# EAGLE design v1.1 (EAGLE 7.3.0)
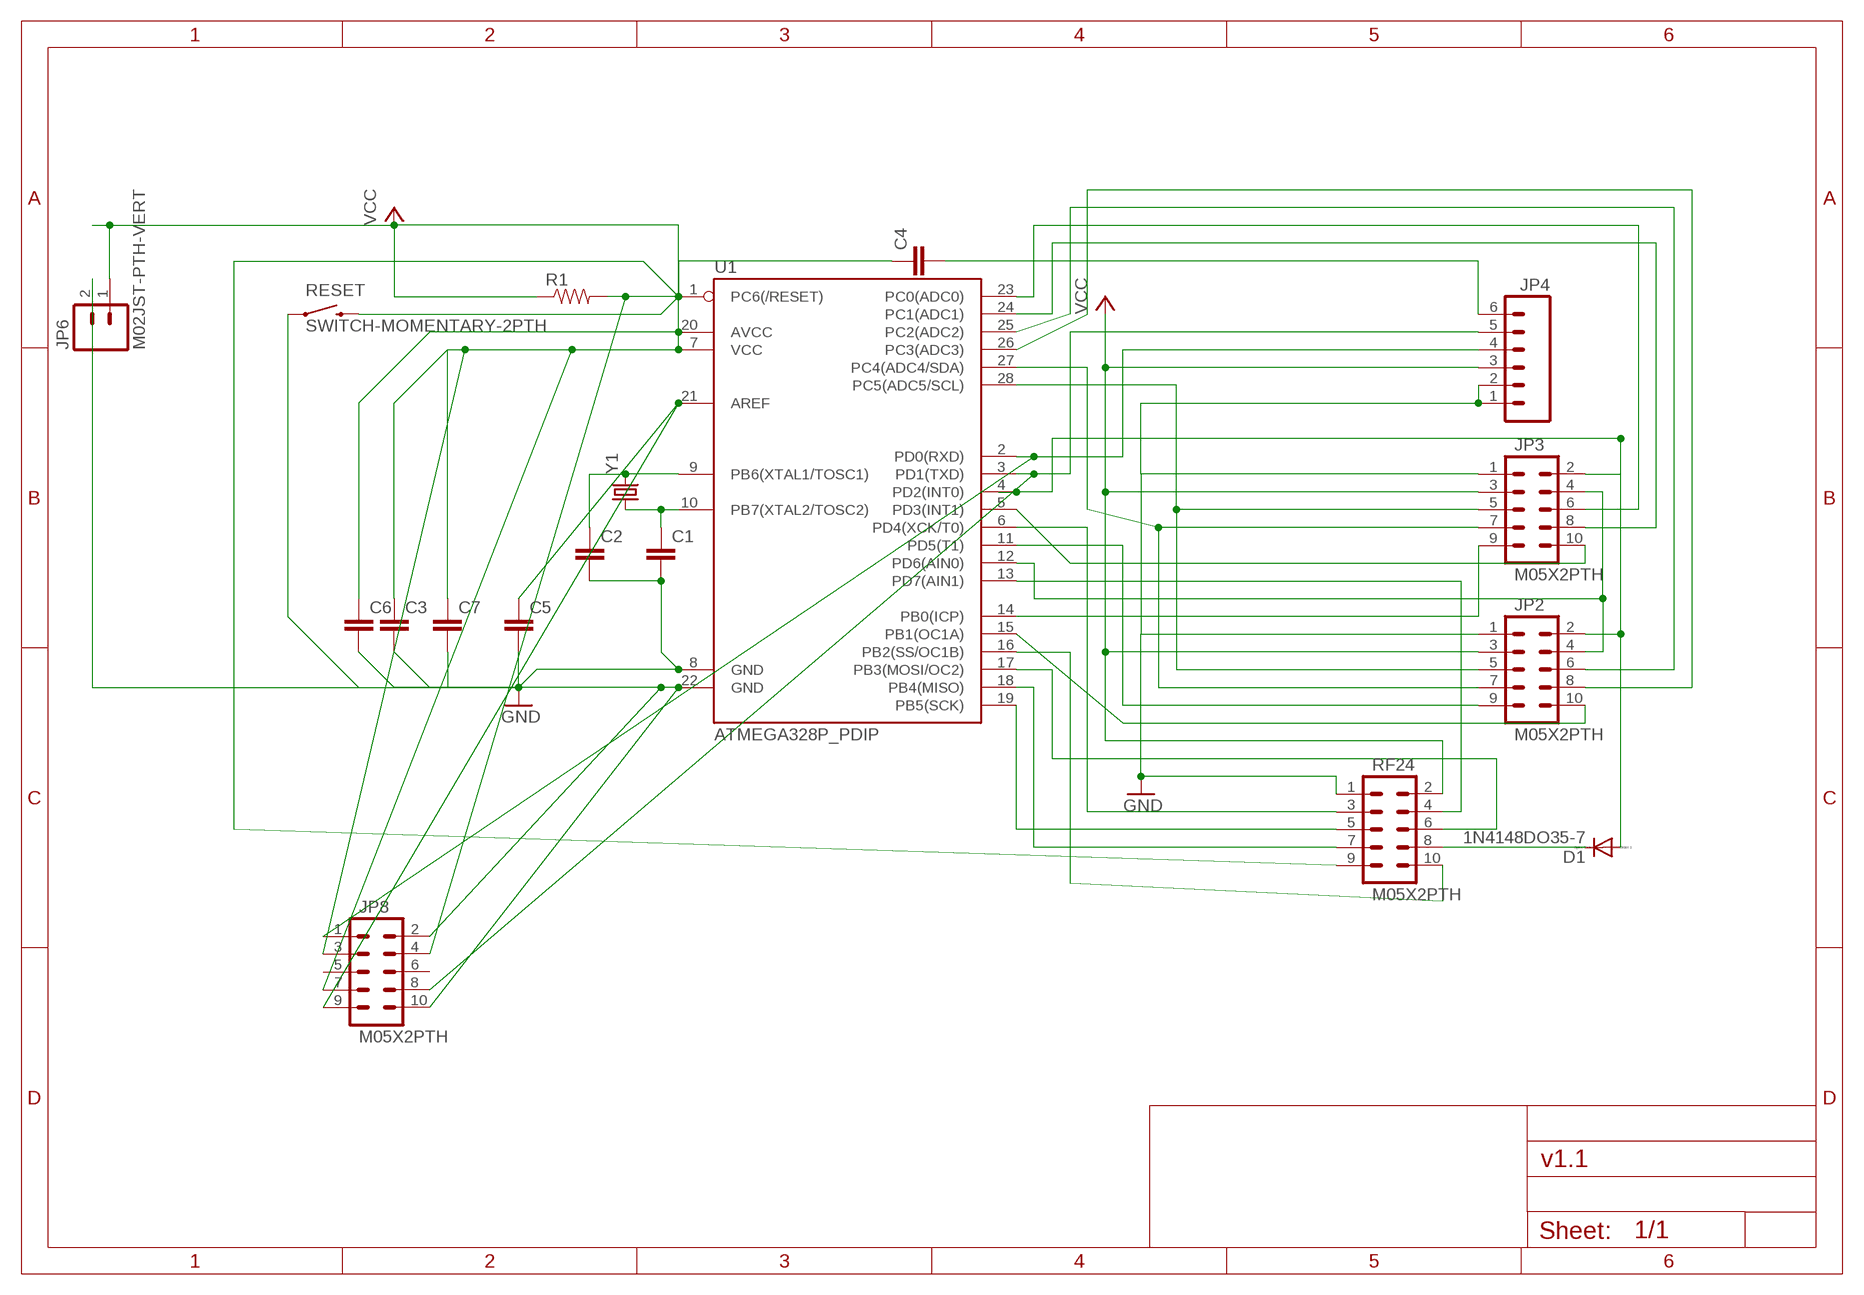
[diagram p0: schematic, sheet 1]

## Parts
C1  CAPPTH  [CAP-PTH-SMALL]
C2  CAPPTH  [CAP-PTH-SMALL]
C3  CAPPTH  [CAP-PTH-SMALL]
C4  CAPPTH  [CAP-PTH-SMALL]
C5  CAPPTH  [CAP-PTH-SMALL]
C6  CAPPTH  [CAP-PTH-SMALL]
C7  CAPPTH  [CAP-PTH-SMALL]
D1  1N4148DO35-7  [DO35-7]
JP2  M05X2PTH  [AVR_ICSP]
JP3  M05X2PTH  [AVR_ICSP]
JP4  M06SILK_FEMALE_PTH  [1X06]
JP6  M02JST-PTH-VERT  [JST-2-PTH-VERT]
JP8  M05X2PTH  [AVR_ICSP]
R1  RESISTORAXIAL-0.3  [AXIAL-0.3]
RESET  SWITCH-MOMENTARY-2PTH  [TACTILE-PTH]
RF24  M05X2PTH  [AVR_ICSP]
U1  ATMEGA328P_PDIP  [DIL28-3]
Y1  CRYSTALHC49US  [HC49US]

## Nets
GND: C1.2 C2.2 C3.2 C5.2 C6.2 C7.2 JP2.1 JP3.1 JP4.1 JP4.2 JP6.2 JP8.2 JP8.10 RESET.1 RF24.1 U1.8(GND) U1.22(GND)
N$1: C2.1 U1.9(PB6(XTAL1/TOSC1)) Y1.2
N$2: C4.1 JP8.4 R1.P$2 RESET.3 RF24.9 U1.1(PC6(/RESET))
N$3: C1.1 U1.10(PB7(XTAL2/TOSC2)) Y1.1
N$4: RF24.10 U1.16(PB2(SS/OC1B))
N$5: JP2.4 JP3.4 U1.12(PD6(AIN0))
N$6: C5.1 JP8.9 U1.21(AREF)
N$9: JP3.9 U1.14(PB0(ICP))
N$10: D1.A JP2.2 JP3.2 U1.4(PD2(INT0))
N$11: JP3.6 U1.23(PC0(ADC0))
N$12: JP3.8 U1.24(PC1(ADC1))
N$13: C4.2 JP4.6
N$14: JP2.6 U1.25(PC2(ADC2))
N$15: JP2.8 U1.26(PC3(ADC3))
N$16: RF24.6 U1.17(PB3(MOSI/OC2))
N$17: JP3.10 U1.5(PD3(INT1))
N$18: JP4.5 JP8.8 U1.3(PD1(TXD))
N$19: JP4.4 JP8.1 U1.2(PD0(RXD))
N$20: RF24.4 U1.13(PD7(AIN1))
N$21: JP2.5 JP3.5 U1.28(PC5(ADC5/SCL))
N$22: JP2.7 JP3.7 U1.27(PC4(ADC4/SDA))
N$23: RF24.5 U1.19(PB5(SCK))
N$24: D1.C RF24.8
N$25: RF24.3 U1.6(PD4(XCK/T0))
N$26: RF24.7 U1.18(PB4(MISO))
N$27: JP2.10 U1.15(PB1(OC1A))
N$28: JP2.9 U1.11(PD5(T1))
VCC: C3.1 C6.1 C7.1 JP2.3 JP3.3 JP4.3 JP6.1 JP8.3 JP8.7 R1.P$1 RF24.2 U1.7(VCC) U1.20(AVCC)
Unconnected: JP8.5 JP8.6

## Library data of the parts
C1-C7 = SparkFun-Passives:CAP: Capacitor Standard 0603 ceramic capacitor, and 0.1" leaded capacitor.
D1 = diode:1N4148: DIODE high speed (Philips)
JP2 JP3 JP8 RF24 = SparkFun-Connectors:M05X2: Header 5x2 Standard 10-pin dual row 0.1" header. Commonly used with AVR-ISP. Use with Spark Fun Electronics SKU: PRT-00778
JP4 = SparkFun-Connectors:M06: Header 6 Standard 6-pin 0.1" header. Use with straight break away headers (SKU : PRT-00116), right angle break away headers (PRT-00553), swiss pins (PRT-00743), machine pins (PRT-00117), and female headers (PRT-00115). Molex polarized connector foot print use with SKU : PRT-08094 with associated crimp pins and housings. NOTES ON THE VARIANTS LOCK and LOCK_LONGPADS... This footprint was designed to help hold the alignment of a through-hole component (i.e. 6-pin header) while soldering it into place. You may notice that each hole has been shifted either up or down by 0.005 of an inch from it's more standard position (which is a perfectly straight line). This slight alteration caused the pins (the squares in the middle) to touch the edges of the holes. Because they are alternating, it causes a "brace" to hold the component in place. 0.005 has proven to be the perfect amount of "off-center" position when using our standard breakaway headers. Although looks a little odd when you look at the bare footprint, once you have a header in there, the alteration is very hard to notice. Also,if you push a header all the way into place, it is covered up entirely on the bottom side. This idea of altering the position of holes to aid alignment will be further integrated into the Sparkfun Library for other footprints. It can help hold any component with 3 or more connection pins.; PROD_ID: CONN-08437
JP6 = SparkFun-Connectors:M02: Standard 2-pin 0.1" header. Use with - straight break away headers ( PRT-00116) - right angle break away headers (PRT-00553) - swiss pins (PRT-00743) - machine pins (PRT-00117) - female headers (PRT-00115) Molex polarized connector foot print use with: PRT-08233 with associated crimp pins and housings. 2.54_SCREWTERM for use with PRT-10571. 3.5mm Screw Terminal footprints for PRT-08084 5mm Screw Terminal footprints for use with PRT-08432
R1 = SparkFun-Passives:RESISTOR: Resistor Basic schematic elements and footprints for 0603, 1206, and PTH resistors.
RESET = SparkFun-Electromechanical:SWITCH-MOMENTARY-2: Various NO switches- pushbuttons, reed, etc
U1 = SparkFun-DigitalIC:ATMEGA328P_PDIP: uC used in the Arduino 32kb flash, 1k EEPROM, 2k SRAM This is the through-hole version of this chip.
Y1 = SparkFun-FreqCtrl:CRYSTAL: Various standard crystals. Proven footprints. Spark Fun Electronics SKU : COM-00534

## Net classes
0 default: clearance 0.205 mm

## Board
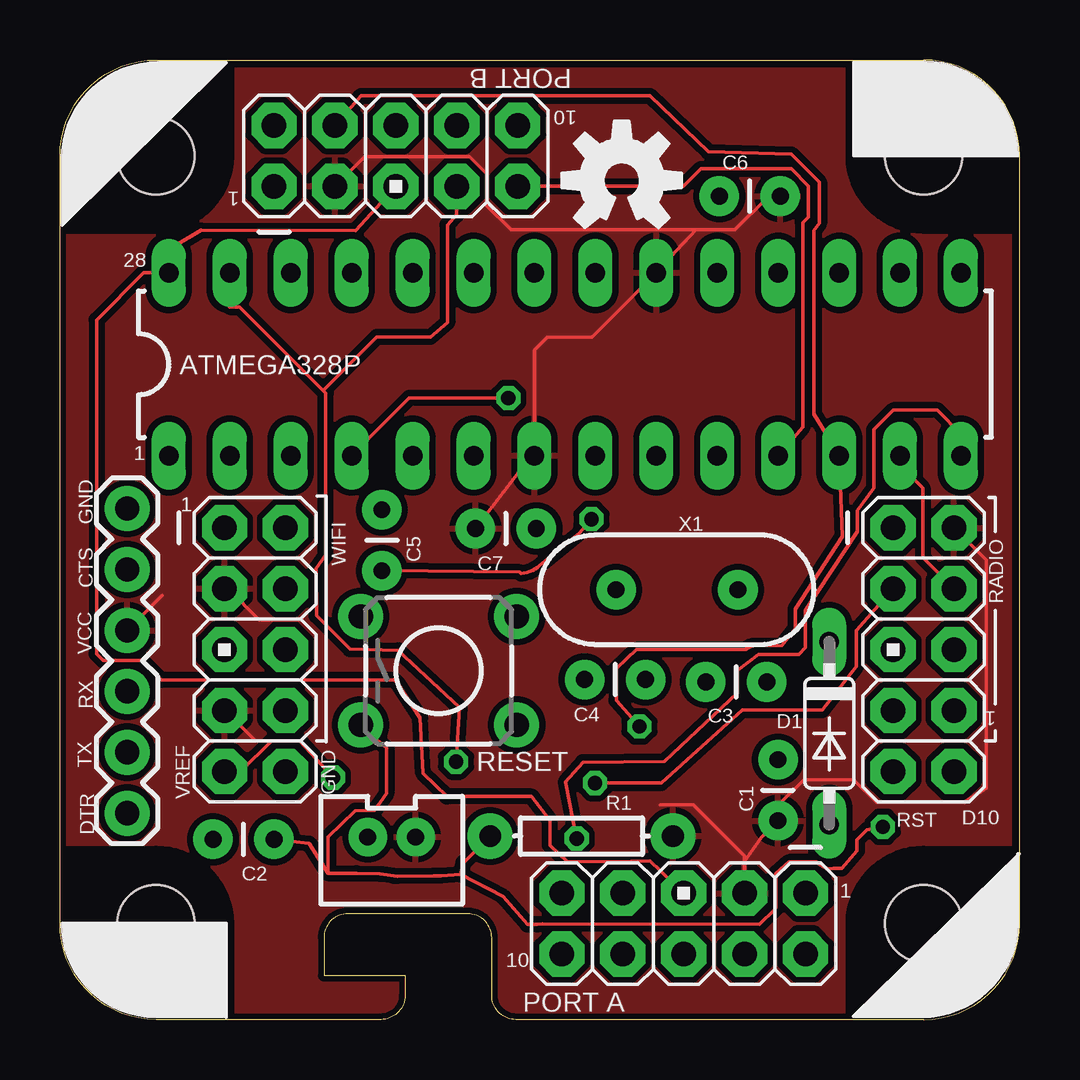
[diagram p1: board, top side]
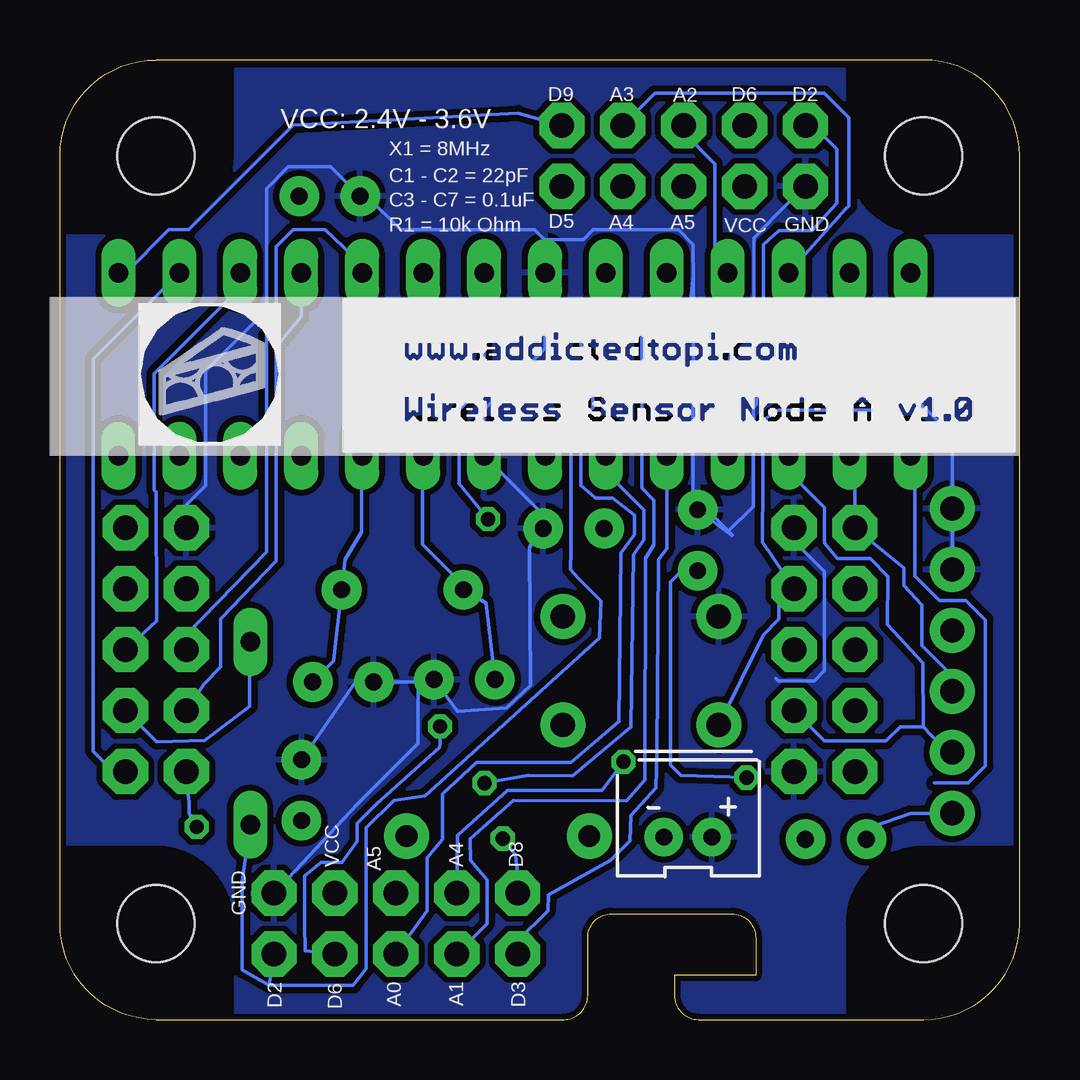
[diagram p2: board, bottom side, seen from below]

Size 40 x 40 mm. Coordinates in mm from the lower left corner, seen from the top.
Outline: 36,0 19,0 arc-90 18,1 18,3.41 arc90 17,4.41 12,4.41 arc90 11,3.41 11,1.84 14.38,1.84 14.38,1 arc-90 13.38,0 4,0 arc-90 0,4 0,36 arc-90 4,40 36,40 arc-90 40,36 40,4 arc-90 36,0
Copper layers (1*16): Top 0.035mm / dielectric 1.5mm / Bottom 0.035mm
Design rules "DFRobot_Eagle_Rule_v0.4": minimum track width 6mil, minimum drill 12mil, track to track 6mil, track to pad 6mil, pad to pad 6mil, via to via 6mil, smd to smd 0mil, copper to edge 10mil, drill to drill 10mil, minimum pad ring 12mil, minimum via ring 8mil, stop-mask expansion 2mil, vias tented up to drill 25mil, thermal gap 10mil

### Footprints (pad centres in the part's own frame; a part is rotated, then mirrored left to right if it is on the bottom)
CAP-PTH-SMALL = drill 0.7 pad 1.651: 1 0,0; 2 2.54,0
DO35-7 = drill 0.813 long: A 3.81,0; C -3.81,0
AVR_ICSP = drill 1.016 pad 1.88 octagon: 1 -1.27,5.08; 2 1.27,5.08; 3 -1.27,2.54; 4 1.27,2.54; 5 -1.27,0; 6 1.27,0; 7 -1.27,-2.54; 8 1.27,-2.54; 9 -1.27,-5.08; 10 1.27,-5.08
1X06 = drill 1.016 pad 1.88: 1 0,0; 2 2.54,0; 3 5.08,0; 4 7.62,0; 5 10.16,0; 6 12.7,0
JST-2-PTH-VERT = drill 0.7 pad 1.6: 1 -1,-0.55; 2 1,-0.55
AXIAL-0.3 = drill 0.9 pad 1.88: P$1 -3.81,0; P$2 3.81,0
TACTILE-PTH = drill 1.016 pad 1.88: 1 -3.251,2.261; 2 3.251,2.261; 3 -3.251,-2.261; 4 3.251,-2.261
DIL28-3 = drill 0.813 long: 1 -16.51,-3.81; 2 -13.97,-3.81; 3 -11.43,-3.81; 4 -8.89,-3.81; 5 -6.35,-3.81; 6 -3.81,-3.81; 7 -1.27,-3.81; 8 1.27,-3.81; 9 3.81,-3.81; 10 6.35,-3.81; 11 8.89,-3.81; 12 11.43,-3.81; 13 13.97,-3.81; 14 16.51,-3.81; 15 16.51,3.81; 16 13.97,3.81; 17 11.43,3.81; 18 8.89,3.81; 19 6.35,3.81; 20 3.81,3.81; 21 1.27,3.81; 22 -1.27,3.81; 23 -3.81,3.81; 24 -6.35,3.81; 25 -8.89,3.81; 26 -11.43,3.81; 27 -13.97,3.81; 28 -16.51,3.81
DP4040_V1_NOLINES = hole 3.2: -16,-16; 16,-16; 16,16; -16,16
HC49US = drill 0.7 pad 1.651: 1 -2.54,0; 2 2.54,0

### Placement (x,y rotation side)
C1  29.46,14.07 180 top
C2  21.87,14.17 0 top
C3  29.93,8.29 90 top
C4  8.92,7.51 180 top
C5  13.42,18.71 90 top
C6  30.03,34.32 180 top
C7  17.32,20.47 0 top
D1  32.07,11.93 270 top
JP2  14,36 90 top
JP3  26,4 270 top
JP4  2.8,21.3 270 top
JP6  13.83,7.05 180 top
JP8  8.13,15.42 0 top
R1  21.74,7.65 180 top
RESET  15.79,14.54 0 top
RF24  36,15.42 0 top
U1  21.05,27.32 0 top
U$1  [DP4040_V1_NOLINES]  20,20 0 top
U$5  [PI]  30.66,23.9 0 top
U$6  [OSHW-LOGO-M]  23.42,34.98 0 top
Y1  25.72,17.92 180 top

### Tracks (layer width: path | path; a pad name or v marks a point on that pad's centre or on a via)
GND
  Bottom 0.152: C2.2 23.42,12.85 21.39,12.98 20.39,13.92 20.42,19.68 20.09,20.23 C7.2 19.48,20.67 U1.8 22.35,23.54 22.35,25.4 19.78,27.97 U1.22 19.81,31.16 19.81,32.51 | JP4.2 JP4.1 2.8,24.34 4.45,25.98 10.85,25.98 10.97,25.86 10.97,25.65 11.1,25.5 11.1,21.39 12.14,20.37 | 19.81,32.51 20.22,32.92 25.81,32.92 27.21,34.32 C6.2 28.72,35.56 30.48,35.56 31.39,34.65 31.39,29.57 33.93,27.03 33.93,22.25 34.73,21.45 RF24.1 | C2.2 24.79,14.07 C1.2 27.69,14.07 C3.2 | JP3.1 27.6,9 25.08,11.52 25.08,13.78 C2.2 | 12.14,20.37 11.97,20.2 11.99,20.18 C5.2 | 12.14,20.37 13.61,21.84 13.6,30.99 | 13.6,30.99 13.61,32.1 13.61,32.3 14.22,32.92 17.78,32.92 18.19,32.51 19.81,32.51 | JP2.1 10.16,33.53 11.07,32.58 11.07,29.97 11.79,29.26 12.8,29.26 13.7,30.16 13.6,30.99 | JP8.2 9.4,19.94 8.13,18.67 8.13,14.55 8.56,14.12 10.06,14.12 10.16,14.22
  pour Bottom (isolate 0.254): 3.05,39.62 36.58,39.62 39.78,36.02 39.73,3.81 35.92,0.18 3.51,0.18 0.23,4.57 0.33,35.99
N$1
  Bottom 0.152: C2.1 22.25,17.37 Y1.2 23.71,18.63 24.89,19.81 24.89,23.48 U1.9
N$2  (via drill 0.6)
  Top 0.152: v34.3,8.03 33.64,7.91 33.22,7.49 33.22,7.04 32.59,6.3 32.23,6.3 31.99,6.29 31.51,6.57 30.39,6.57 29.84,6.08 29.84,4.65 29.79,4.59 29.16,3.98 20.12,3.99 19.89,3.96 19.48,3.96 18.47,5.13 16.69,6.04 | 16.69,6.04 15.88,5.99 15.57,5.99 14.07,5.97 13.94,5.99 13.35,6.07 12.36,6.1 11.18,6.1 | 16.69,6.04 16.82,6.53 R1.P$2 | C4.1 10.38,7.33 11.18,6.1 | RESET.3 12.53,12.23 13.61,11.33 13.61,9.42 13.12,8.72 12.3,8.7 11.18,7.62 11.18,6.1
  Bottom 0.152: 3.56,9.86 2.13,9.86 1.42,10.57 1.42,16.66 2.23,17.48 3.35,17.48 4.37,18.49 4.37,23.34 U1.1 4.54,23.84 6.1,25.4 10.06,25.4 10.67,24.99 10.72,19.92 JP8.4 10.03,17.32 10.03,16.69 10.68,16.04 RESET.3 | RF24.9 34.73,10.14 34.62,9.03 34.62,9.09 34.61,8.6 v34.3,8.03
N$3
  Bottom 0.152: C1.1 28.59,14.95 Y1.1 28.11,19.19 27.43,20.32 27.43,23.48 U1.10
N$4
  Bottom 0.152: RF24.10 37.77,10.34 38.61,11.18 38.61,27.54 U1.16
N$5  (via drill 0.6)
  Top 0.152: v24.16,12.22 23.19,13.31 23.19,14.63 24.03,15.42 28.57,15.42 28.83,15.57 28.88,15.57 30.1,15.6 30.66,16.31 30.66,17.12 32.61,20.14 32.48,23.34 U1.12 31.42,25.23 31.42,32.89 31.65,33.2 31.65,34.9 30.48,36.07 27.03,36.17 24.59,38.51 12.56,38.51 JP2.4
  Bottom 0.152: v24.16,12.22 24.16,11.49 24.19,11.34 26.8,9 27.61,8.18 27.61,7.42 28.25,6.55 29.11,6.55 29.8,6 29.8,4 29.77,2.86 JP3.4
N$6  (via drill 0.6)
  Top 0.152: v22.16,20.86 21.65,20.29 20.09,19 arc-36 19.23,18.59 19.16,18.65 C5.1 | JP8.9 7.54,10.34 8.81,11.61 9.98,11.61 v11.38,10.08
  Bottom 0.152: U1.21 22.32,26.45 23.37,25.4 23.37,22.35 v22.16,20.86 | C5.1 14.08,18.71 14.55,18.24 14.55,10.62 14.12,10.19 v11.38,10.08
N$9  (via drill 0.6)
  Top 0.152: U1.14 37.56,24.42 36.58,25.4 34.75,25.4 33.93,24.59 33.93,22.15 33.25,21.21 33.25,20.34 31.06,17.04 31.06,15.52 30.81,15.21 29.11,15.21 28.25,14.55 28.25,13.61 25.2,10.77 21.79,10.72 21.08,9.91 v21.54,7.54
  Bottom 0.152: JP3.9 20.93,6.1 21.01,6.84 v21.54,7.54
N$10  (via drill 0.6)
  Top 0.152: v18.69,25.91 14.56,25.91 U1.4
  Bottom 0.152: JP3.2 31.28,1.43 | 31.28,1.43 32.42,2.06 32.42,5.77 D1.A | U1.4 12.06,28.11 10.67,29.77 10.67,32.31 10.03,32.89 8.66,32.89 7.62,34.04 7.62,36.27 8.62,37.27 JP2.2 | 31.28,1.43 27.77,1.42 27.24,2.12 27.23,7.99 26.08,9.14 24.79,9.32 17.51,15.9 17.45,17.45 18.39,18.39 18.72,18.77 18.69,19.56 v18.69,25.91
N$11
  Bottom 0.152: U1.23 17.24,30.51 18.29,29.46 18.29,28.04 17.78,27.53 17.78,25.5 18.29,24.99 18.29,22.25 17.68,21.74 16.97,21.74 16.05,21.03 16.05,20.22 16.61,19.46 16.69,12.42 18.69,10.72 22.63,10.72 24.05,9.4 24.05,7.52 24.7,6.75 24.7,4.53 JP3.6
N$12
  Bottom 0.152: U1.24 14.7,30.71 15.75,29.67 15.75,22.15 15.24,21.64 15.24,19.81 15.6,19.23 15.62,9.98 16.38,9.12 21.1,9.13 22.91,7.53 22.89,6.63 22.2,5.83 22.2,4 JP3.8
N$13
  Bottom 0.152: JP4.6 4.54,8.6 6.1,8.06 6.1,7.96 C4.2
N$14
  Bottom 0.152: U1.25 12.7,31.67 12.7,35.66 14,36.96 JP2.6
N$15
  Bottom 0.152: U1.26 7.23,33.79 7.11,33.91 7.11,37.59 8.13,38.61 15.2,38.61 JP2.8
N$16
  Bottom 0.152: U1.17 32.48,30.51 36.07,26.92 36.07,22.07 36,22 35.97,16.62 RF24.6
N$17
  Bottom 0.152: U1.5 14.7,19.64 15.06,19.18 15.11,11.2 15.16,9.65 16.2,8.51 16.25,7.45 17.06,6.64 19.63,5.21 19.66,4.52 20.93,3.28 JP3.10
N$18
  Bottom 0.152: JP4.5 3.01,11.14 4.01,12.19 | 4.01,12.19 4.04,14.86 5.51,16.46 5.49,18.47 6.22,19.23 7.59,19.23 8.13,19.86 8.13,21.34 9.62,22.83 U1.3 | JP8.8 8.13,11.61 5.56,11.61 4.98,12.19 4.01,12.19
N$19
  Bottom 0.152: JP4.4 2.8,14.33 4.06,15.6 4.06,17.27 4.83,18.09 4.83,18.82 JP8.1 6.86,23.29 U1.2
N$20
  Top 0.152: U1.13 35.02,23.09 35.97,22.15 35.97,19.26 RF24.4
N$21
  Top 0.152: JP3.5 24.6,6.62 23.8,6.6 21.16,6.58 20.42,7.26 20.42,8.31 19.66,9.3 16.13,9.3 15.14,10.26 15.01,12.57 14.07,14.02 13.95,14.15 4.22,14.15 3.4,14.96 1.8,14.96 1.52,15.24 1.52,29.16 3.49,31.13 U1.28 4.71,31.13 4.71,32.17 4.8,32.26 5.88,32.9 12.32,32.88 JP2.5
N$22  (via drill 0.6)
  Top 0.152: 10.97,26.21 7.49,29.7 7.08,29.7 U1.27 | 10.97,26.21 11.07,26.11 11.07,19.36 10.67,18.8 10.69,16.84 12.09,15.44 14.1,15.39 16.66,13.01 v16.51,10.74 | 10.97,26.21 13.21,28.45 15.44,28.45 16.15,29.06 16.15,33.12 16.54,33.55 JP2.7
  Bottom 0.152: JP3.7 23.43,7.68 21.34,9.55 17.4,9.55 v16.51,10.74
N$23
  Bottom 0.152: RF24.5 34.76,16.02 31.39,19.49 31.39,28.55 30.99,29.06 30.99,32.21 30.28,32.92 28.95,32.92 27.4,31.46 U1.19
N$24
  Bottom 0.152: D1.C 32.09,13.06 33.97,11.64 35.97,11.58 RF24.8
N$25  (via drill 0.6)
  Top 0.152: v22.3,9.86 25.07,9.86 28.45,12.9 31.77,12.9 33.2,14.72 33.2,16.23 RF24.3
  Bottom 0.152: U1.6 17.24,22.83 15.65,21.23 15.65,20.02 16.1,19.36 16.2,12.19 18.64,10.16 20.5,10.19 v22.3,9.86
N$26
  Bottom 0.152: U1.18 29.94,29.29 30.99,28.04 30.99,19.11 33.3,16.7 33.3,14.7 34,14 RF24.7
N$27
  Bottom 0.152: U1.15 37.25,31.13 35.46,32.92 34.65,32.92 30.28,37.29 20.9,37.79 JP2.10
N$28
  Top 0.152: JP2.9 25.99,34.73 26.72,35.46 30.48,35.46 31.19,34.75 31.19,33.45 30.96,33.22 30.96,24.71 U1.11
VCC
  Top 0.152: U1.20 22.18,28.45 20.32,28.45 19.78,27.91 U1.7 19.65,23.51 C7.1 | 24.93,31.13 24.93,31.23 26.52,32.92 | 26.52,32.92 28.14,32.92 29.46,34.24 29.94,34.24 C6.1 | 4.27,17.69 JP4.3 | RF24.2 38.61,19.16 38.61,9.65 37.69,9.04 34.05,9.05 33.1,10 31,10 29.93,8.93 C3.1 29.23,7.59 28.54,6.59 JP3.3 28.52,6.73 28.52,6.83 26.42,8.94 25.02,8.94 | 26.52,32.92 26.42,32.92 18.8,32.92 17.78,33.93 17.78,35.26 17.07,35.97 12.7,35.97 JP2.3 | 6.86,12.95 JP8.7 6.88,12.88 8.13,11.63 | JP8.3 7.01,17.96 8.31,16.66 10.03,16.66 10.08,16.71
  pour Top (isolate 0.254): 35.62,0 4,0 arc-90 0,4 0,35.62 arc-90 4,39.62 35.62,39.62 arc-90 39.62,35.62 39.62,4 arc-90

### Text on the board
tPlace: PORT B | 10 | 1 | C6 | 28 | ATMEGA328P | 1 | GND | 1 | X1 | WIFI | C5 | C7 | CTS | RADIO | VCC | RX | 1 | C4 | C3 | D1 | TX | RESET | VREF | GND | R1 | C1 | DTR | RST | D10 | C2 | 1 | 10 | PORT A
bPlace: D2 | D6 | A2 | A3 | D9 | VCC: 2.4V - 3.6V | X1 = 8MHz | C1 - C2 = 22pF | C3 - C7 = 0.1uF | GND | VCC | A5 | A4 | D5 | R1 = 10k Ohm | D8 | A4 | A5 | VCC | GND | D3 | A1 | A0 | D6 | D2